# Altium schematic sheet DSI&CSI CONNECTOR.SchDoc
size A4; SheetNumber: 10; SheetTotal: 11
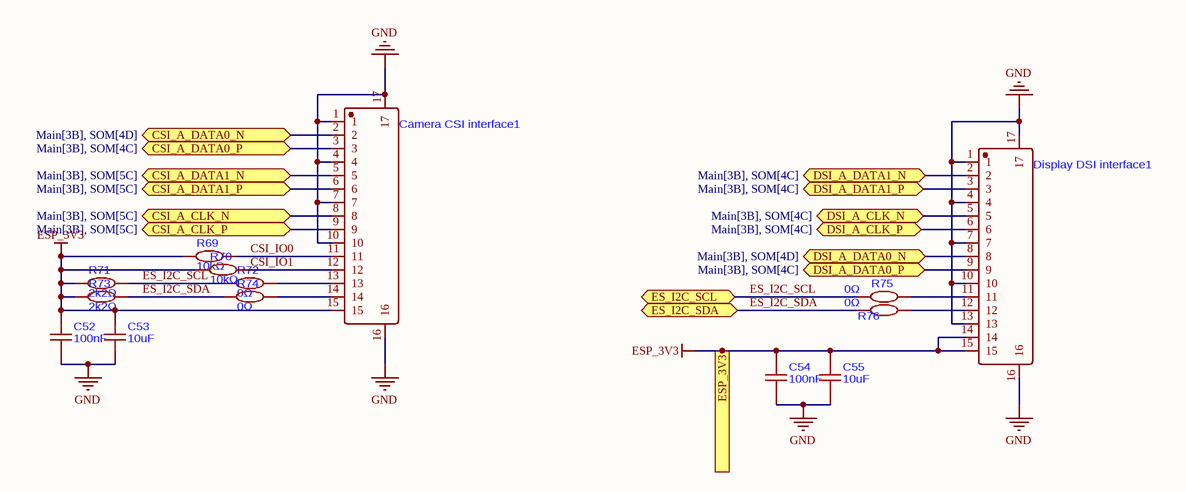
[diagram p0: DSI&CSI CONNECTOR.SchDoc]

## Parts
C52  100nF  [C0603]
C53  10uF  [C0603]
C54  100nF  [C0603]
C55  10uF  [C0603]
Camera_CSI_interface1  CONN FFC FPC 15POS 1mm BOTTOM CNT SMD R/A  [FPC-SMD_15P-P1.00_XUNPU_FPC-1.0FX-15PWCR-H20]  (value not drawn)
Display_DSI_interface1  CONN FFC FPC 15POS 1mm BOTTOM CNT SMD R/A  [FPC-SMD_15P-P1.00_XUNPU_FPC-1.0FX-15PWCR-H20]  (value not drawn)
R69  10kΩ  [R0603]
R70  10kΩ  [R0603]
R71  2k2Ω  [R0603]
R72  0Ω  [R0603]
R73  2k2Ω  [R0603]
R74  0Ω  [R0603]
R75  0Ω  [R0603]
R76  0Ω  [R0603]

## Ports
CSI_A_CLK_N (bidir, see Main[3B], SOM[5C]), CSI_A_CLK_P (bidir, see Main[3B], SOM[5C]), CSI_A_DATA0_N (bidir, see Main[3B], SOM[4D]), CSI_A_DATA0_P (bidir, see Main[3B], SOM[4C]), CSI_A_DATA1_N (bidir, see Main[3B], SOM[5C]), CSI_A_DATA1_P (bidir, see Main[3B], SOM[5C]), DSI_A_CLK_N (bidir, see Main[3B], SOM[4C]), DSI_A_CLK_P (bidir, see Main[3B], SOM[4C]), DSI_A_DATA0_N (bidir, see Main[3B], SOM[4D]), DSI_A_DATA0_P (bidir, see Main[3B], SOM[4C]), DSI_A_DATA1_N (bidir, see Main[3B], SOM[4C]), DSI_A_DATA1_P (bidir, see Main[3B], SOM[4C]), ES_I2C_SCL (bidir, see Main[4B], AUDIO CODEC[1B], interfaceUART&I2C[2C], SOM[6C]), ES_I2C_SDA (bidir, see Main[4B], AUDIO CODEC[1A], interfaceUART&I2C[2C], SOM[6C]), ESP_3V3 (in, see Main[4B], ETH-PHY[2A], interfaceUART&I2C[1C], Power[4C], SOM[6B])

## Nets
ESP_3V3: C52.2 C53.2 C54.2 C55.2 Camera_CSI_interface1.15 Display_DSI_interface1.14 Display_DSI_interface1.15 R69.1 R70.1 R71.1 R73.1 ; port ESP_3V3
GND: C52.1 C53.1 C54.1 C55.1 Camera_CSI_interface1.1 Camera_CSI_interface1.4 Camera_CSI_interface1.7 Camera_CSI_interface1.10 Camera_CSI_interface1.16 Camera_CSI_interface1.17 Display_DSI_interface1.1 Display_DSI_interface1.4 Display_DSI_interface1.7 Display_DSI_interface1.10 Display_DSI_interface1.13 Display_DSI_interface1.16 Display_DSI_interface1.17
CSI_A_CLK_N: Camera_CSI_interface1.8 ; port CSI_A_CLK_N
CSI_A_CLK_P: Camera_CSI_interface1.9 ; port CSI_A_CLK_P
CSI_A_DATA0_N: Camera_CSI_interface1.2 ; port CSI_A_DATA0_N
CSI_A_DATA0_P: Camera_CSI_interface1.3 ; port CSI_A_DATA0_P
CSI_A_DATA1_N: Camera_CSI_interface1.5 ; port CSI_A_DATA1_N
CSI_A_DATA1_P: Camera_CSI_interface1.6 ; port CSI_A_DATA1_P
CSI_IO0: Camera_CSI_interface1.11 R69.2
CSI_IO1: Camera_CSI_interface1.12 R70.2
DSI_A_CLK_N: Display_DSI_interface1.5 ; port DSI_A_CLK_N
DSI_A_CLK_P: Display_DSI_interface1.6 ; port DSI_A_CLK_P
DSI_A_DATA0_N: Display_DSI_interface1.8 ; port DSI_A_DATA0_N
DSI_A_DATA0_P: Display_DSI_interface1.9 ; port DSI_A_DATA0_P
DSI_A_DATA1_N: Display_DSI_interface1.2 ; port DSI_A_DATA1_N
DSI_A_DATA1_P: Display_DSI_interface1.3 ; port DSI_A_DATA1_P
ES_I2C_SCL: R71.2 R72.1 R75.1 ; port ES_I2C_SCL
ES_I2C_SDA: R73.2 R74.1 R76.1 ; port ES_I2C_SDA
NetCamera_CSI_interface1_13: Camera_CSI_interface1.13 R72.2
NetCamera_CSI_interface1_14: Camera_CSI_interface1.14 R74.2
NetDisplay_DSI_interface1_11: Display_DSI_interface1.11 R75.2
NetDisplay_DSI_interface1_12: Display_DSI_interface1.12 R76.2

## Library data of the parts
C52 C54 = CC0603KRX7R9BB104: 50V 100nF X7R ±10% 0603 Ceramic Capacitors ROHS
C53 C55 = CL10A106MA8NRNC: 25V 10uF X5R ±20% 0603 Ceramic Capacitors ROHS
Camera_CSI_interface1 Display_DSI_interface1 = FPC-1.0FX-15PWCR-H20: -25℃~+85℃ Hinged Lid 15P 1mm 500mA 50V Bottom Contact Surface Mount, Right Angle SMD,P=1mm,Surface Mount,Right Angle FFC, FPC (Flat Flexible) Connector Assemblies RoHS
R69 R70 = RC0603FR-0710KL: 100mW 10kΩ 75V ±100ppm/℃ Thick Film Resistor ±1% 0603 Chip Resistor - Surface Mount ROHS
R71 R73 = RC0603FR-072K2L: 100mW 2.2kΩ 75V ±100ppm/℃ Thick Film Resistor ±1% 0603 Chip Resistor - Surface Mount RoHS
R72 R74-R76 = RC0603JR-070RL: 100mW 0Ω 75V Thick Film Resistor ±5% 0603 Chip Resistor - Surface Mount RoHS